# EAGLE design RFID_Reader_v1.0 (EAGLE 9.6.2)
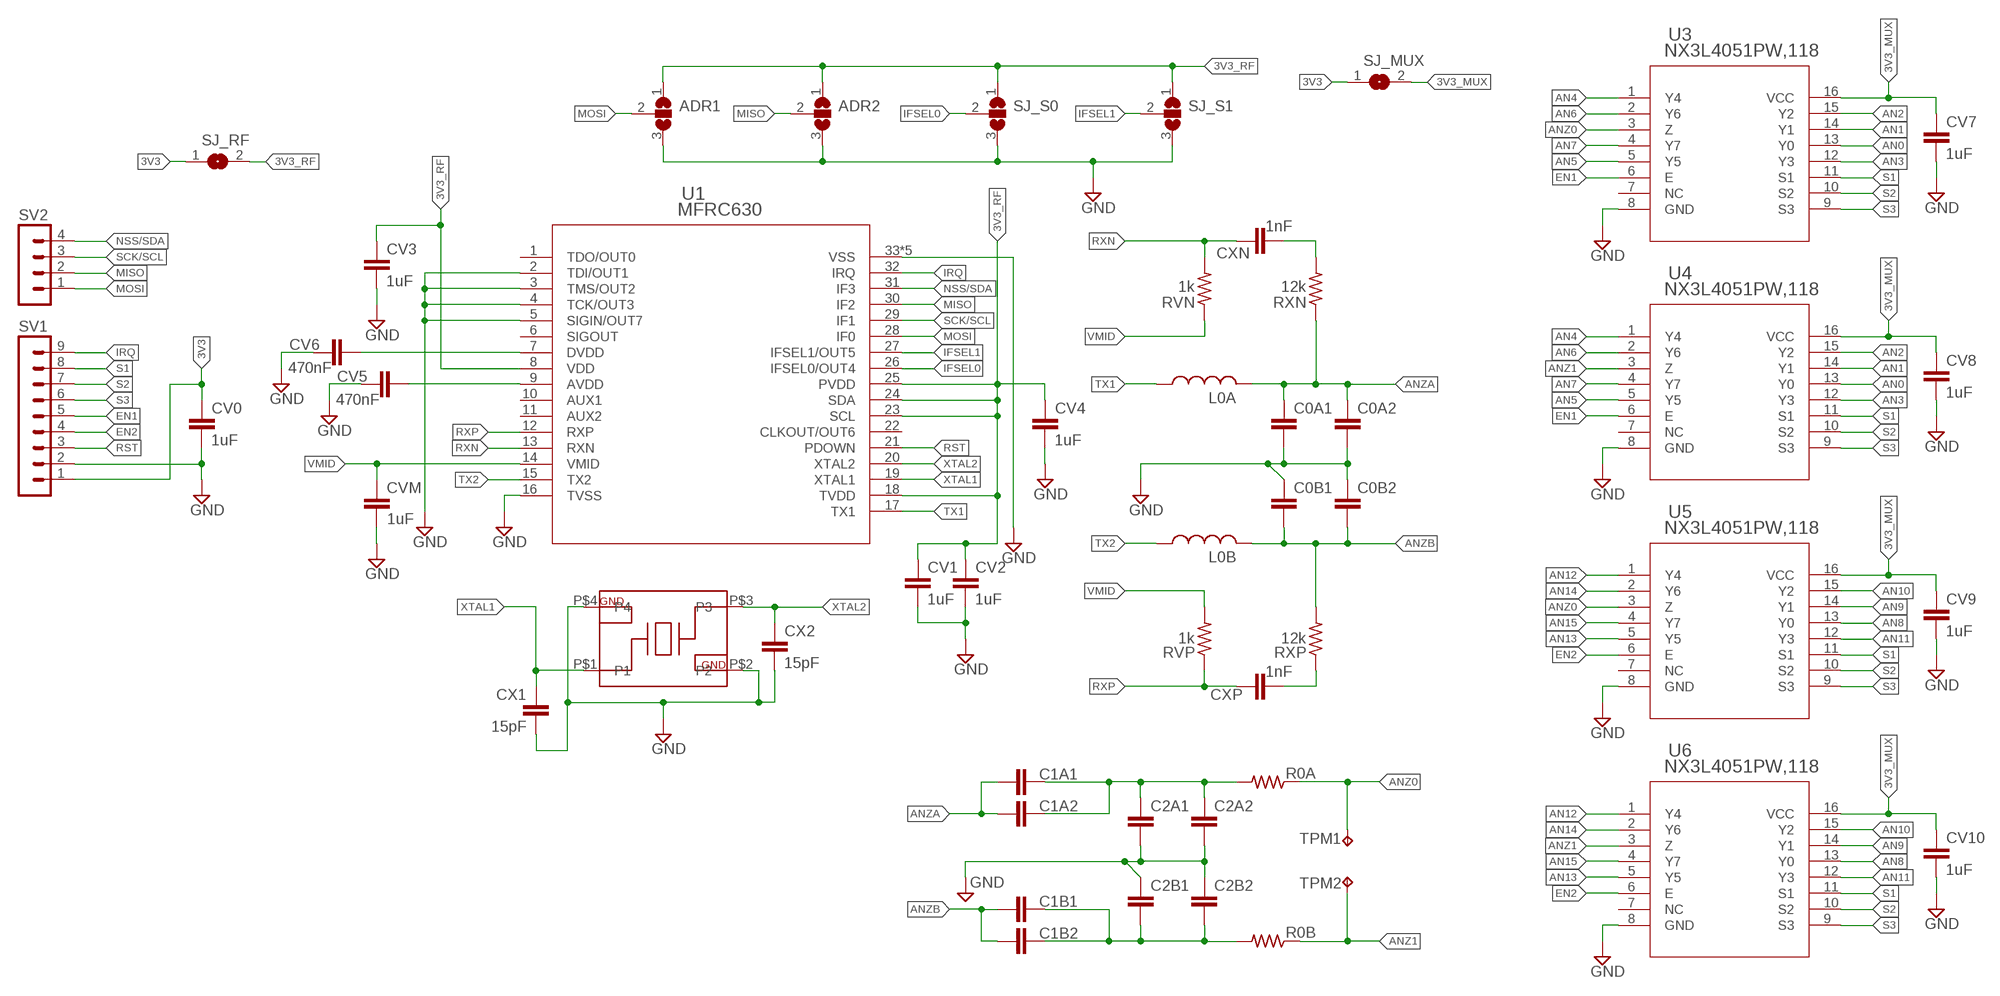
[diagram p0: schematic, sheet 1]

## Parts
ADR1  SJ2W  [SJ_2]
ADR2  SJ2W  [SJ_2]
C0A1  C-EUC0805  [C0805]
C0A2  C-EUC0805  [C0805]
C0B1  C-EUC0805  [C0805]
C0B2  C-EUC0805  [C0805]
C1A1  C-EUC0805  [C0805]
C1A2  C-EUC0805  [C0805]
C1B1  C-EUC0805  [C0805]
C1B2  C-EUC0805  [C0805]
C2A1  C-EUC0805  [C0805]
C2A2  C-EUC0805  [C0805]
C2B1  C-EUC0805  [C0805]
C2B2  C-EUC0805  [C0805]
CV0  1uF  C-EUC0402  [C0402]
CV1  1uF  C-EUC0402  [C0402]
CV2  1uF  C-EUC0402  [C0402]
CV3  1uF  C-EUC0402  [C0402]
CV4  1uF  C-EUC0402  [C0402]
CV5  470nF  C-EUC0402  [C0402]
CV6  470nF  C-EUC0402  [C0402]
CV7  1uF  C-EUC0402  [C0402]
CV8  1uF  C-EUC0402  [C0402]
CV9  1uF  C-EUC0402  [C0402]
CV10  1uF  C-EUC0402  [C0402]
CVM  1uF  C-EUC0402  [C0402]
CX1  15pF  C-EUC0402  [C0402]
CX2  15pF  C-EUC0402  [C0402]
CXN  1nF  C-EUC0805  [C0805]
CXP  1nF  C-EUC0805  [C0805]
L0A  L0806  [L0806]
L0B  L0806  [L0806]
R0A  R-US_R0805  [R0805]
R0B  R-US_R0805  [R0805]
RVN  1k  R-US_R0805  [R0805]
RVP  1k  R-US_R0805  [R0805]
RXN  12k  R-US_R0805  [R0805]
RXP  12k  R-US_R0805  [R0805]
SJ_MUX  SJ  [SJ]
SJ_RF  SJ  [SJ]
SJ_S0  SJ2W  [SJ_2]
SJ_S1  SJ2W  [SJ_2]
SV1  MA09-1  [MA09-1]
SV2  MA04-1  [MA04-1]
TPM1  TPTP10R  [TP10R]
TPM2  TPTP10R  [TP10R]
U1  MFRC630  MFRC63002HN,118HVQFN32_SOT617-1_NXP-M  [HVQFN32_SOT617-1_NXP-M]
U2  E3SB27  E3SB27E0X000VEE3SB27E0X000VE  [DFN320X250X75-4N]
U3  NX3L4051PW,118  NX3L4051PW,118TSSOP16_NXP-M  [TSSOP16_NXP-M]
U4  NX3L4051PW,118  NX3L4051PW,118TSSOP16_NXP-M  [TSSOP16_NXP-M]
U5  NX3L4051PW,118  NX3L4051PW,118TSSOP16_NXP-M  [TSSOP16_NXP-M]
U6  NX3L4051PW,118  NX3L4051PW,118TSSOP16_NXP-M  [TSSOP16_NXP-M]

## Nets
3V3: CV0.1 SJ_MUX.1 SJ_RF.1 SV1.1
3V3_MUX: CV7.1 CV8.1 CV9.1 CV10.1 SJ_MUX.2 U3.16(VCC) U4.16(VCC) U5.16(VCC) U6.16(VCC)
3V3_RF: ADR1.1 ADR2.1 CV1.1 CV2.1 CV3.1 CV4.1 SJ_RF.2 SJ_S0.1 SJ_S1.1 U1.8(VDD) U1.18(TVDD) U1.23(SCL) U1.24(SDA) U1.25(PVDD)
AN0: U3.13(Y0) U4.13(Y0)
AN1: U3.14(Y1) U4.14(Y1)
AN2: U3.15(Y2) U4.15(Y2)
AN3: U3.12(Y3) U4.12(Y3)
AN4: U3.1(Y4) U4.1(Y4)
AN5: U3.5(Y5) U4.5(Y5)
AN6: U3.2(Y6) U4.2(Y6)
AN7: U3.4(Y7) U4.4(Y7)
AN8: U5.13(Y0) U6.13(Y0)
AN9: U5.14(Y1) U6.14(Y1)
AN10: U5.15(Y2) U6.15(Y2)
AN11: U5.12(Y3) U6.12(Y3)
AN12: U5.1(Y4) U6.1(Y4)
AN13: U5.5(Y5) U6.5(Y5)
AN14: U5.2(Y6) U6.2(Y6)
AN15: U5.4(Y7) U6.4(Y7)
ANZ0: R0A.1 TPM1.TP U3.3(Z) U5.3(Z)
ANZ1: R0B.1 TPM2.TP U4.3(Z) U6.3(Z)
ANZA: C0A1.1 C0A2.1 C1A1.2 C1A2.2 L0A.2 RXN.1
ANZB: C0B1.2 C0B2.2 C1B1.2 C1B2.2 L0B.2 RXP.2
EN1: SV1.5 U3.6(E) U4.6(E)
EN2: SV1.4 U5.6(E) U6.6(E)
GND: ADR1.3 ADR2.3 C0A1.2 C0A2.2 C0B1.1 C0B2.1 C2A1.2 C2A2.2 C2B1.1 C2B2.1 CV0.2 CV1.2 CV2.2 CV3.2 CV4.2 CV5.2 CV6.2 CV7.2 CV8.2 CV9.2 CV10.2 CVM.2 CX1.2 CX2.2 SJ_S0.3 SJ_S1.3 SV1.2 U1.2(TDI/OUT1) U1.3(TMS/OUT2) U1.4(TCK/OUT3) U1.5(SIGIN/OUT7) U1.16(TVSS) U1.33(VSS) U1.P$1(VSS) U1.P$2(VSS) U1.P$3(VSS) U1.P$4(VSS) U2.P$2(P2) U2.P$4(P4) U3.8(GND) U4.8(GND) U5.8(GND) U6.8(GND)
IFSEL0: SJ_S0.2 U1.26(IFSEL0/OUT4)
IFSEL1: SJ_S1.2 U1.27(IFSEL1/OUT5)
IRQ: SV1.9 U1.32(IRQ)
MISO: ADR2.2 SV2.2 U1.30(IF2)
MOSI: ADR1.2 SV2.1 U1.28(IF0)
N$1: C1B1.1 C1B2.1 C2B1.2 C2B2.2 R0B.2
N$2: CXN.2 RXN.2
N$3: C1A1.1 C1A2.1 C2A1.1 C2A2.1 R0A.2
N$19: CXP.2 RXP.1
N$26: CV6.1 U1.7(DVDD)
N$28: CV5.1 U1.9(AVDD)
NSS/SDA: SV2.4 U1.31(IF3)
RST: SV1.3 U1.21(PDOWN)
RXN: CXN.1 RVN.2 U1.13(RXN)
RXP: CXP.1 RVP.1 U1.12(RXP)
S1: SV1.8 U3.11(S1) U4.11(S1) U5.11(S1) U6.11(S1)
S2: SV1.7 U3.10(S2) U4.10(S2) U5.10(S2) U6.10(S2)
S3: SV1.6 U3.9(S3) U4.9(S3) U5.9(S3) U6.9(S3)
SCK/SCL: SV2.3 U1.29(IF1)
TX1: L0A.1 U1.17(TX1)
TX2: L0B.1 U1.15(TX2)
VMID: CVM.1 RVN.1 RVP.2 U1.14(VMID)
XTAL1: CX1.1 U1.19(XTAL1) U2.P$1(P1)
XTAL2: CX2.1 U1.20(XTAL2) U2.P$3(P3)
Unconnected: U1.1(TDO/OUT0) U1.6(SIGOUT) U1.10(AUX1) U1.11(AUX2) U1.22(CLKOUT/OUT6) U3.7(NC) U4.7(NC) U5.7(NC) U6.7(NC)

## Library data of the parts
ADR1 ADR2 SJ_S0 SJ_S1 = jumper:SJ2W: SMD solder JUMPER
C0A1 C0A2 C0B1 C0B2 C1A1 C1A2 C1B1 C1B2 C2A1 C2A2 C2B1 C2B2 CV0 CV1-CV10 CVM CX1 CX2 CXN CXP = rcl:C-EU: CAPACITOR, European symbol; SPICEPREFIX: C
L0A L0B = SMD_Components:L0806
R0A R0B RVN RVP RXN RXP = rcl:R-US_: RESISTOR, American symbol; SPICEPREFIX: R
SJ_MUX SJ_RF = jumper:SJ: SMD solder JUMPER
SV1 = con-lstb:MA09-1: PIN HEADER; OC_FARNELL: unknown; OC_NEWARK: unknown
SV2 = con-lstb:MA04-1: PIN HEADER; OC_FARNELL: unknown; OC_NEWARK: unknown
TPM1 TPM2 = testpad:TP: Test pad
U1 = MFRC630:MFRC63002HN,118; COPYRIGHT: Copyright (C) 2024 Ultra Librarian. All rights reserved.; MANUFACTURER_PART_NUMBER: MFRC63002HN,118; MFR_NAME: NXP
U2 = E3SB27E0X000VE:E3SB27E0X000VE
U3-U6 = NX3L4051PW,118:NX3L4051PW,118; COPYRIGHT: Copyright (C) 2024 Ultra Librarian. All rights reserved.; MANUFACTURER_PART_NUMBER: NX3L4051PW,118; MFR_NAME: NXP

## Board
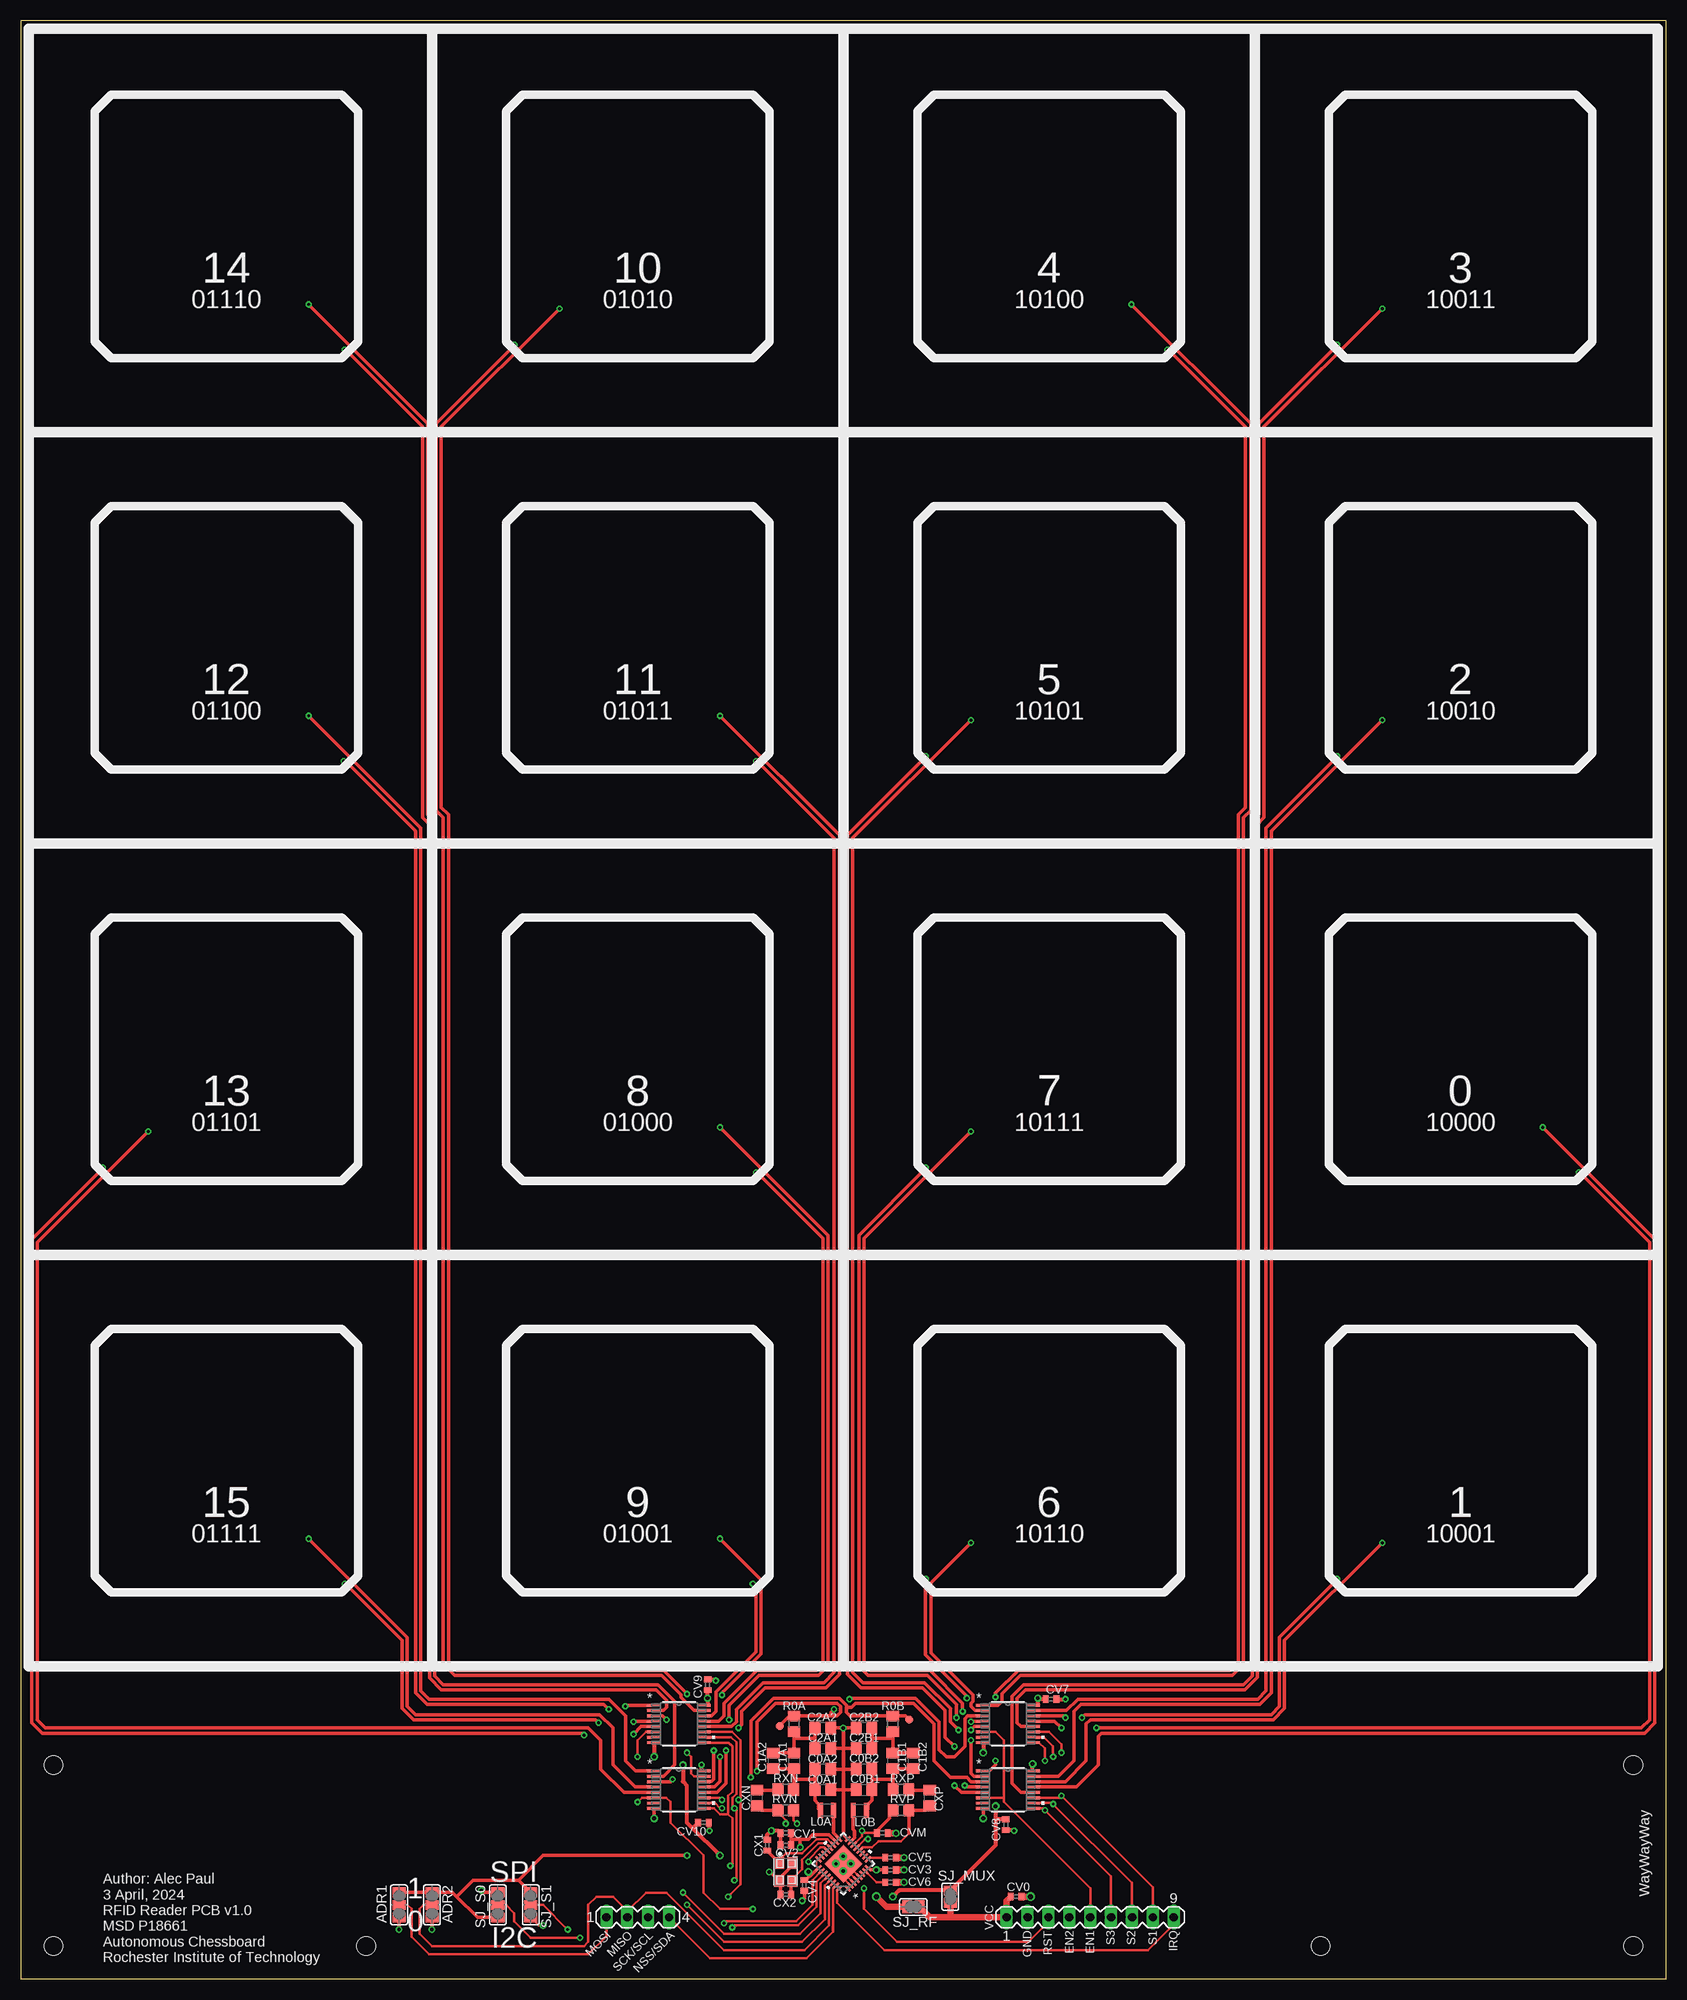
[diagram p1: board, top side]
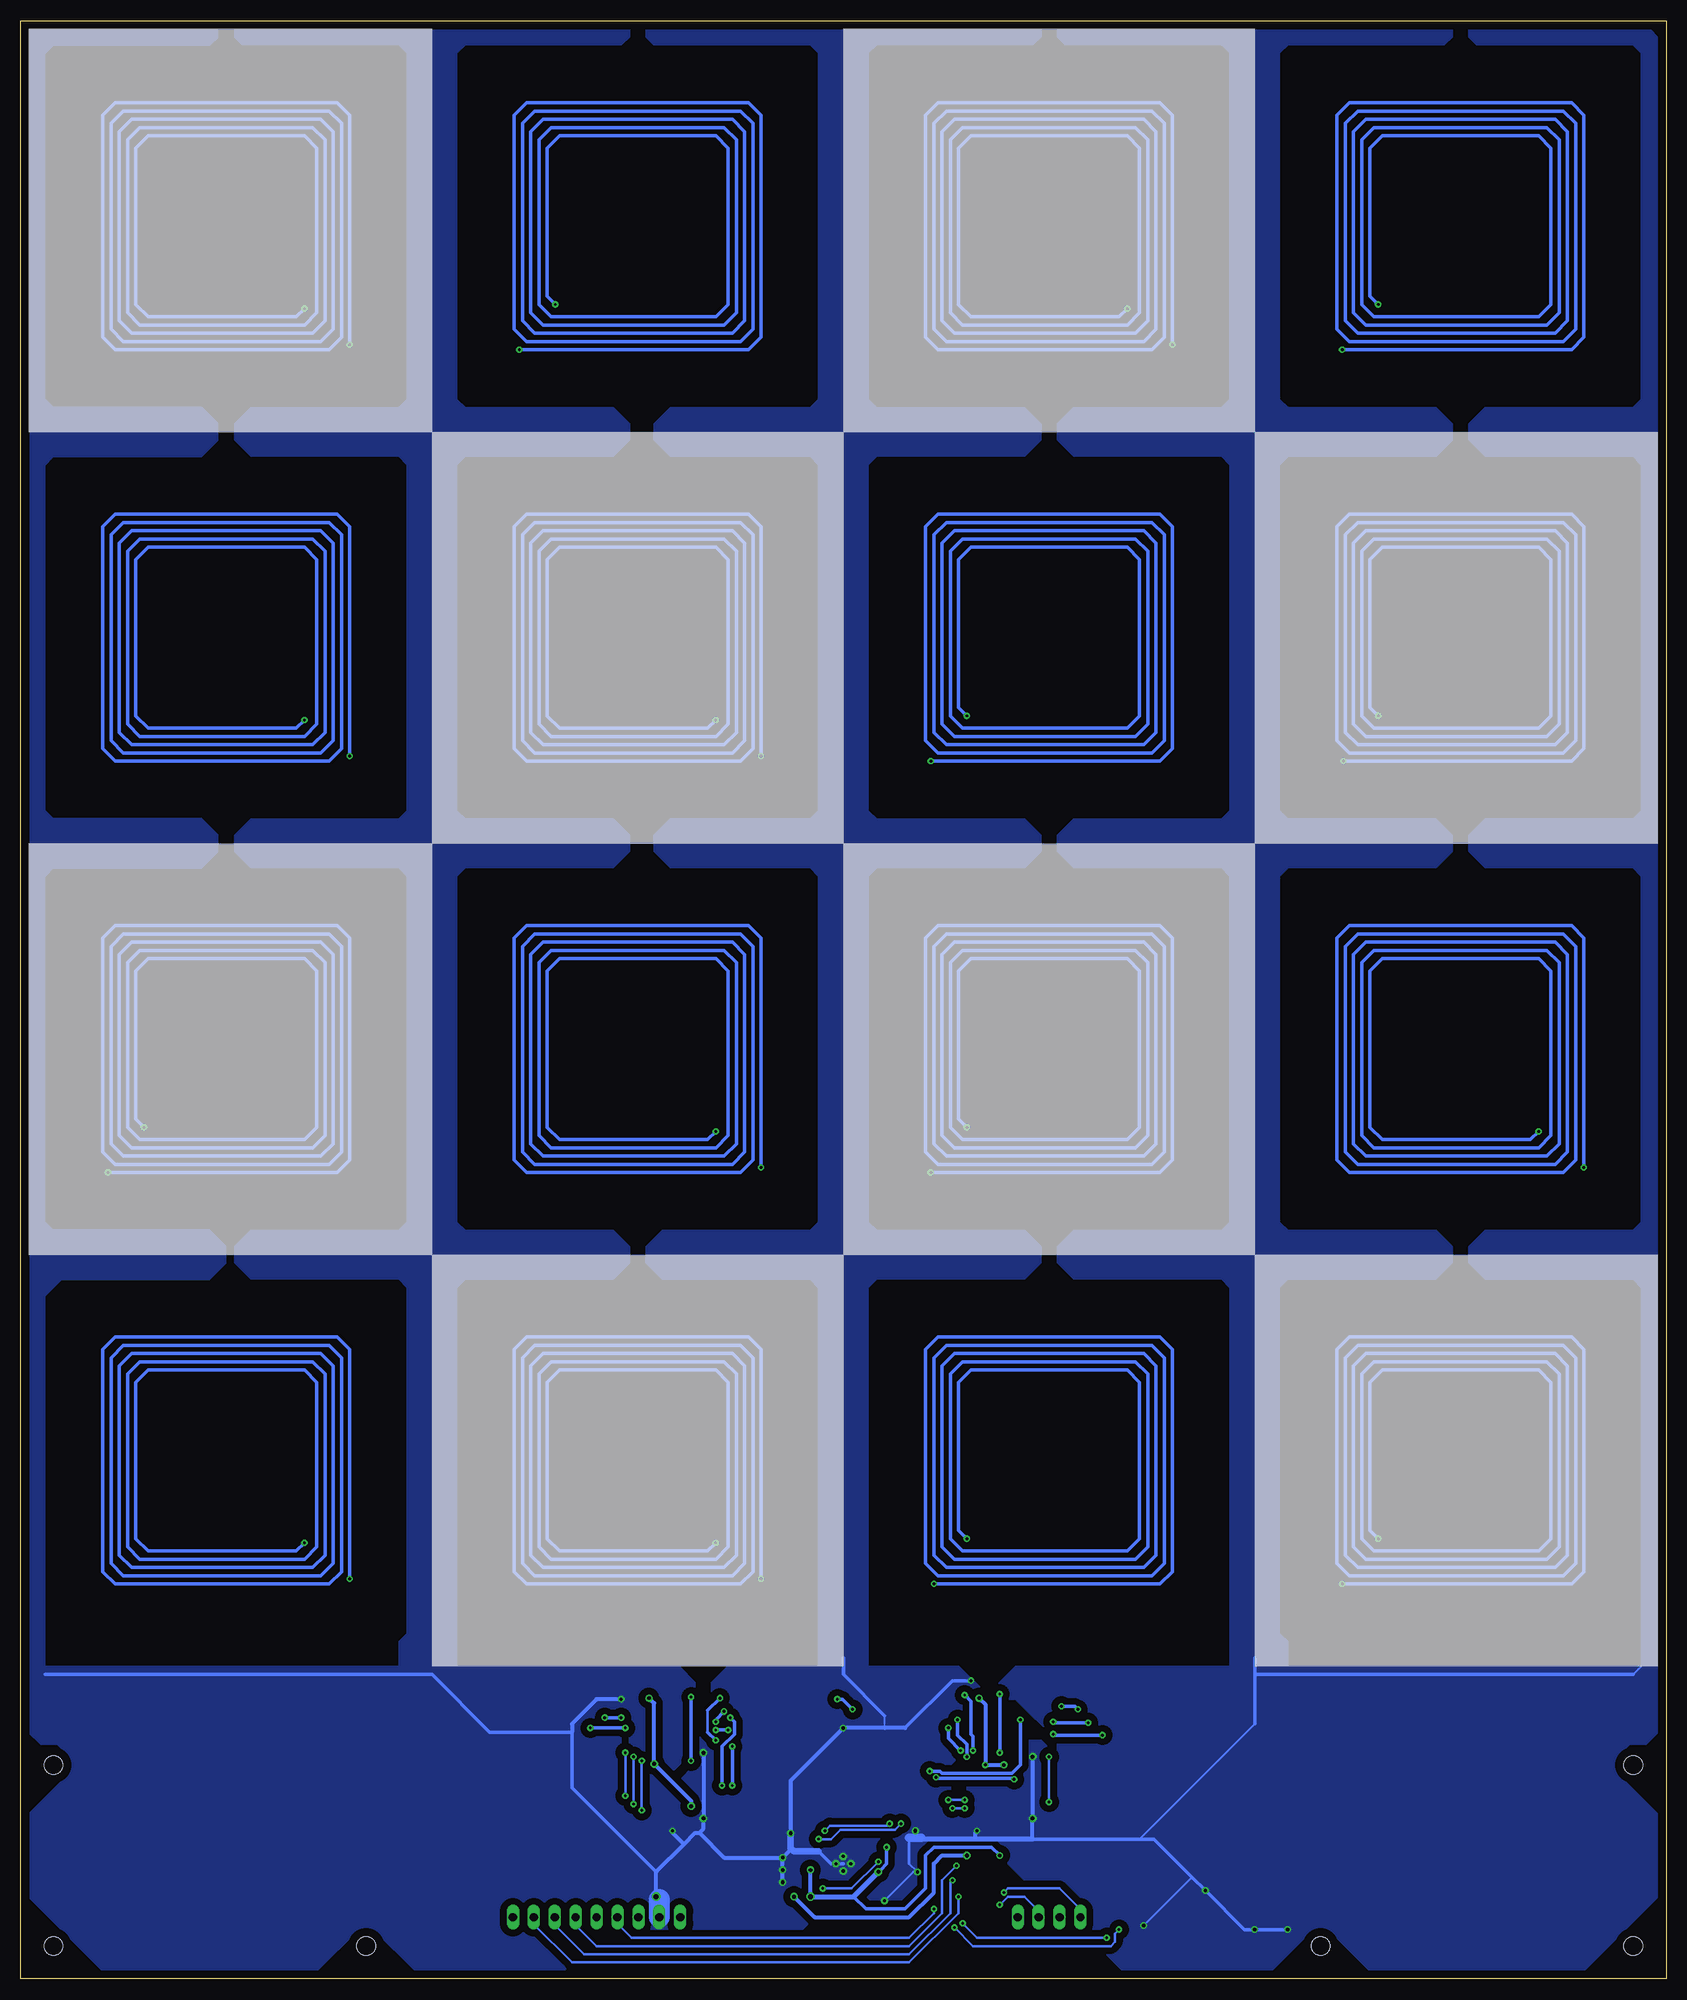
[diagram p2: board, bottom side, seen from below]

Size 200 x 238 mm. Coordinates in mm from the lower left corner, seen from the top.
Outline: 0,0 200,0 200,238 0,238 0,0
Copper layers (1*16): Top 0.035mm / dielectric 1.5mm / Bottom 0.035mm
Design rules "default *": minimum track width 6mil, minimum drill 0.35mm, track to track 5mil, track to pad 5mil, pad to pad 5mil, via to via 5mil, smd to smd 5mil, copper to edge 40mil, drill to drill 6mil, minimum pad ring 10mil, minimum via ring 8mil, stop-mask expansion 4mil, vias tented up to drill 0mil, thermal gap 10mil
Holes 2.3 mm at 4,4 4,26 196,4 196,26 42,4 158,4

### Footprints (pad centres in the part's own frame; a part is rotated, then mirrored left to right if it is on the bottom)
SJ_2 = smd 1.168 x 1.6: 1 -1.524,0; 2 0,0; 3 1.524,0
C0805 = smd 1.3 x 1.5: 1 -0.95,0; 2 0.95,0
C0402 = smd 0.7 x 0.9: 1 -0.65,0; 2 0.65,0
L0806 = smd 0.6 x 1.8: 1 -0.8,0; 2 0.8,0
R0805 = smd 1.3 x 1.5: 1 -0.95,0; 2 0.95,0
SJ = smd 1.168 x 1.6: 1 -0.762,0; 2 0.762,0
MA09-1 = drill 1.016 long: 1 -10.16,0; 2 -7.62,0; 3 -5.08,0; 4 -2.54,0; 5 0,0; 6 2.54,0; 7 5.08,0; 8 7.62,0; 9 10.16,0
MA04-1 = drill 1.016 long: 1 -3.81,0; 2 -1.27,0; 3 1.27,0; 4 3.81,0
TP10R = smd 1 x 1: TP 0,0
HVQFN32_SOT617-1_NXP-M = smd 0.914 x 0.254: 1 -2.502,1.75; 2 -2.502,1.25; 3 -2.502,0.75; 4 -2.502,0.25; 5 -2.502,-0.25; 6 -2.502,-0.75; 7 -2.502,-1.25; 8 -2.502,-1.75; 17 2.502,-1.75; 18 2.502,-1.25; 19 2.502,-0.75; 20 2.502,-0.25; 21 2.502,0.25; 22 2.502,0.75; 23 2.502,1.25; 24 2.502,1.75 | smd 0.254 x 0.914: 9 -1.75,-2.502; 10 -1.25,-2.502; 11 -0.75,-2.502; 12 -0.25,-2.502; 13 0.25,-2.502; 14 0.75,-2.502; 15 1.25,-2.502; 16 1.75,-2.502; 25 1.75,2.502; 26 1.25,2.502; 27 0.75,2.502; 28 0.25,2.502; 29 -0.25,2.502; 30 -0.75,2.502; 31 -1.25,2.502; 32 -1.75,2.502 | smd 3.251 x 3.251: 33 0,0 | drill 0.4: P$1 -0.635,0.635; P$2 0.635,0.635; P$3 -0.635,-0.635; P$4 0.635,-0.635
DFN320X250X75-4N = smd 1.4 x 1.2: P$1 -1.1,-0.8; P$2 1.1,-0.8; P$3 1.1,0.8; P$4 -1.1,0.8
TSSOP16_NXP-M = smd 1.613 x 0.356: 1 -3.054,2.275; 2 -3.054,1.625; 3 -3.054,0.975; 4 -3.054,0.325; 5 -3.054,-0.325; 6 -3.054,-0.975; 7 -3.054,-1.625; 8 -3.054,-2.275; 9 3.054,-2.275; 10 3.054,-1.625; 11 3.054,-0.975; 12 3.054,-0.325; 13 3.054,0.325; 14 3.054,0.975; 15 3.054,1.625; 16 3.054,2.275

### Placement (x,y rotation side)
ADR1  46,9 270 top
ADR2  50,9 270 top
C0A1  97.5,23 0 top
C0A2  97.5,25.5 0 top
C0B1  102.5,23 0 top
C0B2  102.5,25.5 0 top
C1A1  94,26.5 270 top
C1A2  91.5,26.5 270 top
C1B1  108.5,26.5 270 top
C1B2  106,26.5 270 top
C2A1  97.5,28 0 top
C2A2  97.5,30.5 0 top
C2B1  102.5,28 0 top
C2B2  102.5,30.5 0 top
CV0  121,10 0 top
CV1  93,17.75 180 top
CV2  93,16.25 180 top
CV3  105.75,13.25 0 top
CV4  95.25,11.38 270 top
CV5  105.75,14.75 0 top
CV6  105.75,11.75 0 top
CV7  125.25,34 0 top
CV8  119.75,18.75 270 top
CV9  83.5,35.75 90 top
CV10  83,19 0 top
CVM  104.75,17.75 0 top
CX1  90.75,16.25 90 top
CX2  93,10.25 180 top
CXN  89.5,22 90 top
CXP  110.5,22 90 top
L0A  98,20.5 180 top
L0B  102,20.5 0 top
R0A  94,31 270 top
R0B  106,31 270 top
RVN  93,20.5 180 top
RVP  107,20.5 180 top
RXN  93,23 180 top
RXP  107,23 180 top
SJ_MUX  113,10 90 top
SJ_RF  108.5,8.75 180 top
SJ_S0  58,9 90 top
SJ_S1  62,9 270 top
SV1  130,7.5 0 top
SV2  75,7.5 0 top
TPM1  92.25,30.75 0 top
TPM2  108,31.5 0 top
U1  100,14 135 top
U2  93,13 270 top
U3  120,31 0 top
U4  120,23 0 top
U5  80,31 0 top
U6  80,23 0 top

### Tracks (layer width: path | path; a pad name or v marks a point on that pad's centre or on a via)
3V3
  Top 0.813: 113,7.5 SV1.1 119.84,9.49 CV0.1 | SJ_MUX.1 113,7.5 | SJ_RF.1 110.51,7.5 113,7.5
3V3_MUX  (via drill 0.35, 0.45, 0.5)
  Top 0.406: 83.5,33.27 U5.16 | U6.16 83,25.33 82.75,25.33 | U3.16 123.53,33.27 123.62,33.38 | U4.16 123,25.33 | 81.72,18.38 81.62,18.38
  Top 0.508: v106,10 106.76,10.76 SJ_MUX.2 118.5,16.26 118.5,19.5 | 83.5,33.27 v83.5,34.12 CV9.1 | 82.75,25.33 v82.75,26 | v85,15 81.62,18.38 81,19 81,23.5 80.5,24 v80.5,26 | 123.62,33.38 v123.62,34.12 123.75,34 CV7.1 | 123,25.33 v123,26.12 | CV10.1 81.72,18.38 | v118.5,21 118.5,19.5 | CV8.1 118.6,19.4 118.5,19.5
  Bottom 0.508: v106,10 103.5,7.5 92,7.5 89,10.5 89,14 88,15 v85,15 | v123.62,34.12 123,33.5 v123,26.12 118.5,21.62 v118.5,21 | v83.5,34.12 82.75,33.38 v82.75,26 v80.5,26
3V3_RF  (via drill 0.4, 0.45, 0.5, 0.6)
  Top 0.203: 96.92,13.47 U1.25 96.75,13.71 96.75,14.29 U1.24 | U1.8 103.13,13.47
  Top 0.254: U1.24 U1.23
  Top 0.406: CV2.1 93.65,17 | 93.65,17 CV1.1 | U1.18 98.27,17.5 96.25,17.5 95.75,17 94.75,17 | CV4.1 95.47,12.02 96.22,12.77 | 96.92,13.47 96.22,12.77 | 96.22,12.77 95.97,12.77 v95.75,13 | 103.13,13.47 103.35,13.25 v104,13.25 CV3.1 | 94.75,17 93.65,17 | v94.75,16 94.75,17 | ADR1.1 ADR2.1 52.48,10.52 53,10 | SJ_S0.1 55.52,7.48 53,10 | SJ_S1.1 60.52,12 | 53,10 55,12 60.52,12 | v81,15 63.52,15 60.52,12
  Top 0.813: SJ_RF.2 105.25,8.75 v104,10
  Bottom 0.406: v95.75,13 95.46,13.29 94.75,14 v94.75,16 | 98.75,10 97.25,8.5 92.5,8.5 90,11 90,15 89,16 82,16 v81,15
  Bottom 0.508: v104,10 v104,13.25
  Bottom 0.61: v104,10 98.75,10 v95.75,13
AN0  (via drill 0.35)
  Top 0.406: U3.13 125.67,31.32 v126.5,30.5 | U4.13 128.32,23.32 131,26 131,29.5 131.38,29.88 197.38,29.88 198.62,31.12 198.62,89.88 v185,103.5 | v130.75,30.5 197,30.5 198,31.5 198,89.5 189.5,98 v189.38,98
  Bottom 0.406: v130.75,30.5 v126.5,30.5 | v189.38,98 161.5,98 160,99.5 160,126.5 161.5,128 188.5,128 190,126.5 190,100.5 188.5,99 162.5,99 161,100.5 161,125.5 162.5,127 187.5,127 189,125.5 189,101.5 187.5,100 163.5,100 162,101.5 162,124.5 163.5,126 186.5,126 188,124.5 188,102.5 186.5,101 164.5,101 163,102.5 163,123.5 164.5,125 185.5,125 187,123.5 187,103.5 185.5,102 165.5,102 164,103.5 164,122.5 165.5,124 184.5,124 186,122.5 186,104.5 v185,103.5
AN1  (via drill 0.35)
  Top 0.406: v127,31.75 126.78,31.98 U3.14 | v129,31.75 129.38,32.12 152,32.12 153,33.12 153,41.5 160,48.5 v160,48.62 | U4.14 126.97,23.98 129.5,26.5 129.5,31 130,31.5 152.25,31.5 153.62,32.88 153.62,41.12 v165.5,53
  Bottom 0.406: v127,31.75 v129,31.75 | v160,48.62 160,76.5 161.5,78 188.5,78 190,76.5 190,49.5 188.5,48 162.5,48 161,49.5 161,75.5 162.5,77 187.5,77 189,75.5 189,50.5 187.5,49 163.5,49 162,50.5 162,74.5 163.5,76 186.5,76 188,74.5 188,51.5 186.5,50 164.5,50 163,51.5 163,73.5 164.5,75 185.5,75 187,73.5 187,52.5 185.5,51 165.5,51 164,52.5 164,72.5 165.5,74 184.5,74 186,72.5 186,53.5 184.5,52 166.5,52 v165.5,53
AN2  (via drill 0.35)
  Top 0.406: U3.15 127.12,32.62 128.5,34 150.38,34 151.38,35 151.38,139.88 160,148.5 v160,148.62 | U4.15 126.12,24.62 128,26.5 128,32.5 128.88,33.38 150.62,33.38 152,34.75 152,139.5 v165.5,153
  Bottom 0.406: v160,148.62 160,176.5 161.5,178 188.5,178 190,176.5 190,149.5 188.5,148 162.5,148 161,149.5 161,175.5 162.5,177 187.5,177 189,175.5 189,150.5 187.5,149 163.5,149 162,150.5 162,174.5 163.5,176 186.5,176 188,174.5 188,151.5 186.5,150 164.5,150 163,151.5 163,173.5 164.5,175 185.5,175 187,173.5 187,152.5 185.5,151 165.5,151 164,152.5 164,172.5 165.5,174 184.5,174 186,172.5 186,153.5 184.5,152 166.5,152 v165.5,153
AN3  (via drill 0.35)
  Top 0.406: U3.12 121.58,30.68 121.12,31.12 121.12,34.12 122.12,35.12 148.81,35.12 150.31,36.62 150.31,140.31 151.12,141.12 151.12,188.62 v165.5,203 | U4.12 121.58,22.68 120.5,23.75 120.5,34.38 121.88,35.75 148.62,35.75 149.69,36.81 149.69,140.69 150.5,141.5 150.5,189 160,198.5 v160,198.62
  Bottom 0.406: v160,198.62 160,226.5 161.5,228 188.5,228 190,226.5 190,199.5 188.5,198 162.5,198 161,199.5 161,225.5 162.5,227 187.5,227 189,225.5 189,200.5 187.5,199 163.5,199 162,200.5 162,224.5 163.5,226 186.5,226 188,224.5 188,201.5 186.5,200 164.5,200 163,201.5 163,223.5 164.5,225 185.5,225 187,223.5 187,202.5 185.5,201 165.5,201 164,202.5 164,222.5 165.5,224 184.5,224 186,222.5 186,203.5 184.5,202 166.5,202 v165.5,203
AN4  (via drill 0.35)
  Top 0.406: U4.1 117.78,25.27 118.5,26 v118.5,26.5 | v118.5,34.25 118.5,34.75 121.25,37.5 147,37.5 148,38.5 148,141.5 148.88,142.38 148.88,188.62 139.5,198 v139.38,198 | U3.1 118.78,33.27 119.25,33.75 119.25,34.62 121.5,36.88 147.25,36.88 148.62,38.25 148.62,141.12 149.5,142 149.5,189 v135,203.5
  Bottom 0.406: v118.5,34.25 v118.5,26.5 | v139.38,198 111.5,198 110,199.5 110,226.5 111.5,228 138.5,228 140,226.5 140,200.5 138.5,199 112.5,199 111,200.5 111,225.5 112.5,227 137.5,227 139,225.5 139,201.5 137.5,200 113.5,200 112,201.5 112,224.5 113.5,226 136.5,226 138,224.5 138,202.5 136.5,201 114.5,201 113,202.5 113,223.5 114.5,225 135.5,225 137,223.5 137,203.5 135.5,202 115.5,202 114,203.5 114,222.5 115.5,224 134.5,224 136,222.5 136,204.5 v135,203.5
AN5  (via drill 0.35)
  Top 0.406: U4.5 114.33,22.68 v113.5,23.5 | v113.5,28.25 112.38,29.38 112.38,32.62 109.62,35.38 102.12,35.38 100.5,37 100.5,139 110,148.5 v110,148.62 | U3.5 115.92,30.68 v115.5,30.25 | v114,30.25 113,31.25 113,32.88 109.88,36 102.38,36 101.12,37.25 101.12,138.62 v115.5,153
  Bottom 0.406: v115.5,30.25 v114,30.25 | v113.5,23.5 v113.5,28.25 | v110,148.62 110,176.5 111.5,178 138.5,178 140,176.5 140,149.5 138.5,148 112.5,148 111,149.5 111,175.5 112.5,177 137.5,177 139,175.5 139,150.5 137.5,149 113.5,149 112,150.5 112,174.5 113.5,176 136.5,176 138,174.5 138,151.5 136.5,150 114.5,150 113,151.5 113,173.5 114.5,175 135.5,175 137,173.5 137,152.5 135.5,151 115.5,151 114,152.5 114,172.5 115.5,174 134.5,174 136,172.5 136,153.5 134.5,152 116.5,152 v115.5,153
AN6  (via drill 0.35)
  Top 0.406: v115,34.12 115,34.38 110,39.38 v110,48.62 | U3.2 116,32.62 115.5,33.12 115.5,33.5 115.75,33.75 115.75,34.5 110.62,39.62 110.62,48.12 v115.5,53 | U4.2 115.88,24.62 115.5,25 v115.5,29
  Bottom 0.305: 116.5,30 116.5,32.62
  Bottom 0.406: v115.5,29 116.5,30 | 116.5,32.62 v115,34.12 | v110,48.62 110,76.5 111.5,78 138.5,78 140,76.5 140,49.5 138.5,48 112.5,48 111,49.5 111,75.5 112.5,77 137.5,77 139,75.5 139,50.5 137.5,49 113.5,49 112,50.5 112,74.5 113.5,76 136.5,76 138,74.5 138,51.5 136.5,50 114.5,50 113,51.5 113,73.5 114.5,75 135.5,75 137,73.5 137,52.5 135.5,51 115.5,51 114,52.5 114,72.5 115.5,74 134.5,74 136,72.5 136,53.5 134.5,52 116.5,52 v115.5,53
AN7  (via drill 0.35)
  Top 0.406: U4.4 114.92,23.32 v114.75,23.5 | v113.75,31.75 113.75,33.38 110.25,36.88 103,36.88 101.88,38 101.88,90.38 110,98.5 v110,98.62 | U3.4 115.58,31.32 v115.5,31.25 | v114.5,32.5 114.5,33.5 110.5,37.5 103.25,37.5 102.5,38.25 102.5,90 v115.5,103
  Bottom 0.406: v113.75,31.75 113.25,31.25 113.25,29.75 114.75,28.25 v114.75,23.5 | v115.5,31.25 115.5,31.5 v114.5,32.5 | v110,98.62 110,126.5 111.5,128 138.5,128 140,126.5 140,99.5 138.5,98 112.5,98 111,99.5 111,125.5 112.5,127 137.5,127 139,125.5 139,100.5 137.5,99 113.5,99 112,100.5 112,124.5 113.5,126 136.5,126 138,124.5 138,101.5 136.5,100 114.5,100 113,101.5 113,123.5 114.5,125 135.5,125 137,123.5 137,102.5 135.5,101 115.5,101 114,102.5 114,122.5 115.5,124 134.5,124 136,122.5 136,103.5 134.5,102 116.5,102 v115.5,103
AN8  (via drill 0.35)
  Top 0.406: U6.13 84.33,23.32 85,24 v85,27 | v86.12,31.5 86.12,33.25 89.75,36.88 97,36.88 98.12,38 98.12,90.38 v85,103.5 | U5.13 84.83,31.32 85.5,32 85.5,33.5 89.5,37.5 96.75,37.5 97.5,38.25 97.5,90 89.5,98 v89.38,98
  Bottom 0.406: v85,27 85,28.5 86.12,29.62 v86.12,31.5 | v89.38,98 61.5,98 60,99.5 60,126.5 61.5,128 88.5,128 90,126.5 90,100.5 88.5,99 62.5,99 61,100.5 61,125.5 62.5,127 87.5,127 89,125.5 89,101.5 87.5,100 63.5,100 62,101.5 62,124.5 63.5,126 86.5,126 88,124.5 88,102.5 86.5,101 64.5,101 63,102.5 63,123.5 64.5,125 85.5,125 87,123.5 87,103.5 85.5,102 65.5,102 64,103.5 64,122.5 65.5,124 84.5,124 86,122.5 86,104.5 v85,103.5
AN9  (via drill 0.35)
  Top 0.406: U6.14 83.08,24 84,24 84.25,24.25 v84.25,27.75 | v85.25,34.5 85.25,34.75 90,39.5 90,48.5 v85,53.5 | U5.14 83.97,31.98 84.5,32.5 84.5,34.88 89.38,39.75 89.38,47.62 v89,48
  Bottom 0.406: v85.25,34.5 84.5,33.75 84.5,29.75 84.25,29.5 v84.25,27.75 | v89,48 61.5,48 60,49.5 60,76.5 61.5,78 88.5,78 90,76.5 90,50.5 88.5,49 62.5,49 61,50.5 61,75.5 62.5,77 87.5,77 89,75.5 89,51.5 87.5,50 63.5,50 62,51.5 62,74.5 63.5,76 86.5,76 88,74.5 88,52.5 86.5,51 64.5,51 63,52.5 63,73.5 64.5,75 85.5,75 87,73.5 87,53.5 85.5,52 65.5,52 64,53.5 64,72.5 65.5,74 84.5,74 86,72.5 86,54.5 v85,53.5
AN10  (via drill 0.35)
  Top 0.305: U6.15 81.88,24.62 81.5,25 81.5,27 v81,27.5
  Top 0.406: v60,198.62 60,198.5 50.5,189 50.5,142 51.38,141.12 51.38,38.25 52.75,36.88 77.88,36.88 80.25,34.5 80.25,34.25 81.88,32.62 U5.15 | v65.5,203 51.12,188.62 51.12,142.38 52,141.5 52,38.5 53,37.5 78.12,37.5 v81,34.62
  Bottom 0.406: v81,27.5 v81,34.62 | v60,198.62 60,226.5 61.5,228 88.5,228 90,226.5 90,199.5 88.5,198 62.5,198 61,199.5 61,225.5 62.5,227 87.5,227 89,225.5 89,200.5 87.5,199 63.5,199 62,200.5 62,224.5 63.5,226 86.5,226 88,224.5 88,201.5 86.5,200 64.5,200 63,201.5 63,223.5 64.5,225 85.5,225 87,223.5 87,202.5 85.5,201 65.5,201 64,202.5 64,222.5 65.5,224 84.5,224 86,222.5 86,203.5 84.5,202 66.5,202 v65.5,203
AN11  (via drill 0.35)
  Top 0.406: U6.12 84.67,22.68 85.75,23.75 v85.75,27.75 | v87.25,30.5 87.62,30.88 87.62,32.5 90.5,35.38 97.88,35.38 99.5,37 99.5,139 v85,153.5 | U5.12 86.42,30.68 87,31.25 87,32.75 90.25,36 97.62,36 98.88,37.25 98.88,138.62 89.5,148 v89.38,148
  Bottom 0.406: v85.75,27.75 87.25,29.25 v87.25,30.5 | v89.38,148 61.5,148 60,149.5 60,176.5 61.5,178 88.5,178 90,176.5 90,150.5 88.5,149 62.5,149 61,150.5 61,175.5 62.5,177 87.5,177 89,175.5 89,151.5 87.5,150 63.5,150 62,151.5 62,174.5 63.5,176 86.5,176 88,174.5 88,152.5 86.5,151 64.5,151 63,152.5 63,173.5 64.5,175 85.5,175 87,173.5 87,153.5 85.5,152 65.5,152 64,153.5 64,172.5 65.5,174 84.5,174 86,172.5 86,154.5 v85,153.5
AN12  (via drill 0.35)
  Top 0.406: U6.1 74.72,25.27 73.5,26.5 73.5,32 71.5,34 49.62,34 48.62,35 48.62,139.88 v35,153.5 | U5.1 73.65,33.27 v73.5,33.12 | v71.5,32.75 70.88,33.38 49.41,33.38 48,34.78 48,139.5 39.5,148 v39.25,148
  Bottom 0.406: v73.5,33.12 71.88,33.12 v71.5,32.75 | v39.25,148 11.5,148 10,149.5 10,176.5 11.5,178 38.5,178 40,176.5 40,150.5 38.5,149 12.5,149 11,150.5 11,175.5 12.5,177 37.5,177 39,175.5 39,151.5 37.5,150 13.5,150 12,151.5 12,174.5 13.5,176 36.5,176 38,174.5 38,152.5 36.5,151 14.5,151 13,152.5 13,173.5 14.5,175 35.5,175 37,173.5 37,153.5 35.5,152 15.5,152 14,153.5 14,172.5 15.5,174 34.5,174 36,172.5 36,154.5 v35,153.5
AN13  (via drill 0.35)
  Top 0.406: U6.5 73.33,22.68 70.5,25.5 70.5,29 69,30.5 3,30.5 2,31.5 2,89.5 v15.5,103 | U5.5 75.42,30.68 v74.5,29.75 | v68.5,29.62 68.25,29.88 2.62,29.88 1.38,31.12 1.38,89.88 10,98.5 v10,98.62
  Bottom 0.406: v74.5,29.75 74.38,29.62 v68.5,29.62 | v10,98.62 10,126.5 11.5,128 38.5,128 40,126.5 40,99.5 38.5,98 12.5,98 11,99.5 11,125.5 12.5,127 37.5,127 39,125.5 39,100.5 37.5,99 13.5,99 12,100.5 12,124.5 13.5,126 36.5,126 38,124.5 38,101.5 36.5,100 14.5,100 13,101.5 13,123.5 14.5,125 35.5,125 37,123.5 37,102.5 35.5,101 15.5,101 14,102.5 14,122.5 15.5,124 34.5,124 36,122.5 36,103.5 34.5,102 16.5,102 v15.5,103
AN14  (via drill 0.35)
  Top 0.406: U6.2 78.12,24.62 79.5,26 79.5,33.75 77.5,35.75 51.38,35.75 50.31,36.81 50.31,140.69 49.5,141.5 49.5,189 v35,203.5 | U5.2 78.12,32.62 78.5,33 78.5,33.88 77.25,35.12 51.12,35.12 49.69,36.56 49.69,140.31 48.88,141.12 48.88,188.62 39.5,198 v39.38,198
  Bottom 0.406: v35,203.5 36,204.5 36,222.5 34.5,224 15.5,224 14,222.5 14,203.5 15.5,202 35.5,202 37,203.5 37,223.5 35.5,225 14.5,225 13,223.5 13,202.5 14.5,201 36.5,201 38,202.5 38,224.5 36.5,226 13.5,226 12,224.5 12,201.5 13.5,200 37.5,200 39,201.5 39,225.5 37.5,227 12.5,227 11,225.5 11,200.5 12.5,199 38.5,199 40,200.5 40,226.5 38.5,228 11.5,228 10,226.5 10,199.5 11.5,198 v39.38,198
AN15  (via drill 0.35)
  Top 0.406: U6.4 74.67,23.32 72,26 72,30.5 70.38,32.12 48,32.12 47,33.12 47,41.5 v35,53.5 | U5.4 74.58,31.32 v74.5,31.25 | v70.25,31.12 69.88,31.5 47.75,31.5 46.38,32.88 46.38,41.12 39.5,48 v39.38,48
  Bottom 0.406: v74.5,31.25 74.38,31.12 v70.25,31.12 | v39.38,48 11.5,48 10,49.5 10,76.5 11.5,78 38.5,78 40,76.5 40,50.5 38.5,49 12.5,49 11,50.5 11,75.5 12.5,77 37.5,77 39,75.5 39,51.5 37.5,50 13.5,50 12,51.5 12,74.5 13.5,76 36.5,76 38,74.5 38,52.5 36.5,51 14.5,51 13,52.5 13,73.5 14.5,75 35.5,75 37,73.5 37,53.5 35.5,52 15.5,52 14,53.5 14,72.5 15.5,74 34.5,74 36,72.5 36,54.5 v35,53.5
ANZ0  (via drill 0.35)
  Top 0.406: TPM1.TP 93.45,31.95 R0A.1 98.5,31.95 | v100.75,34 100.88,34.12 108.75,34.12 111.62,31.25 111.62,27.88 112.5,27 113.5,27 114.75,28.25 114.75,31.62 115.1,31.98 U3.3 | 98.5,31.95 99.2,31.95 99.62,32.38 99.62,33.12 99.25,33.5 91.75,33.5 89.5,31.25 v89.5,25.25 | v98.88,32.75 98.5,32.38 98.5,31.95 | U5.3 78.03,31.98 v78.5,31.5
  Bottom 0.406: v98.88,32.75 100.12,34 v100.75,34 | v89.5,25.25 88.25,25.25 88,25 79.5,25 78.5,26 v78.5,31.5
ANZ1  (via drill 0.35)
  Top 0.406: TPM2.TP 107.55,31.95 R0B.1 100.8,31.95 100.38,32.38 100.38,33 | 100.38,33 100.38,33.25 99.5,34.12 91.5,34.12 88.75,31.38 v88.75,24.5 | 100.38,33 101,33 101.5,33.5 108.5,33.5 111,31 111,26.5 113,24.5 115,24.5 115.53,23.98 U4.3 | v79.25,24.25 78.97,23.98 U6.3
  Bottom 0.406: v88.75,24.5 88.62,24.38 79.38,24.38 v79.25,24.25
ANZA
  Top 0.406: C1A2.2 C1A1.2 94,24.25 | 96.55,24.25 C0A1.1 96.55,21.7 97,21.25 97,20.7 L0A.2 | 96.55,24.25 C0A2.1 | RXN.1 94,23.05 94,24.25 | 94,24.25 96.55,24.25
ANZB
  Top 0.406: C1B1.2 C1B2.2 106,24.25 | 103.45,24.25 C0B1.2 103.45,21.7 103,21.25 103,20.7 L0B.2 | 103.45,24.25 C0B2.2 | RXP.2 106,23.05 106,24.25 | 106,24.25 103.45,24.25
EN1
  Top 0.305: U3.6 118.47,30.02 119.5,29 119.5,22 | SV1.5 130,11 119.5,21.5 119.5,22 | U4.6 116.97,22 119.5,22
EN2  (via drill 0.35)
  Top 0.305: v89,8.5 85,8.5 83,10.5 83,15 79,19 79,21.5 78.47,22.02 U6.6 75.53,22.02 v75,21.5 | U5.6 76.03,30.02 75,29 v75,27
  Bottom 0.305: SV1.4 127.46,6.71 125.75,5 92,5 89,8 v89,8.5 | v75,27 v75,21.5
GND  (via drill 0.35, 0.4, 0.45, 0.5, 0.6)
  Top 0.152: U1.16 100.51,17.03 | U1.33 U1.P$2
  Top 0.254: U1.3 100,12.94 | 100,12.94 U1.P$1 100.54,13.1 U1.4 | U1.5 100.9,13.46 U1.P$3 | U1.2 100,12.23 100,12.94
  Top 0.305: 93.8,13.8 U2.P$4 | 92.35,11.75 U2.P$2 | SJ_S1.3 62.98,6.5 v63.5,6.5 | 91.1,13 v91,13
  Top 0.406: C0A1.2 100,23 | 100,23 C0B1.1 | C0B2.1 100,25.5 | 100,25.5 C0A2.2 | 100,25.5 100,23 | C2A1.2 100,28 | 100,28 C2B1.1 | 100,28 100,25.5 | v100,30.5 C2B2.1 | v100,30.5 100,28 | CV1.2 CV2.2 | 100,23 100,17.54 100.51,17.03 | 93.8,13.8 92.2,12.2 U2.P$2 91.1,13 | CX2.2 92.35,11.75 | v100,30.5 C2A2.2 | ADR1.3 v46,6 | v50,6 ADR2.3 | v56,10.75 56.23,10.52 SJ_S0.3 | U3.8 117,28.67 | v77,19.5 77,20.67 U6.8 | U5.8 77,28.67 | v117,19.5 117,20.67 U4.8 | CV4.2 95.25,9.75 v95,9.5 | v83.75,18 83.65,18.1
  Top 0.508: 117,28.67 v117,27.5 | 77,28.67 v77,27 | CV1.2 92.1,18 v91.25,18 90.75,17.5 CX1.2 | CV9.2 84.35,36.4 v84.5,36.25 | CV10.2 83.65,18.1 | CV7.2 v127,34 | CV8.2 120.65,18.1 v120.75,18
  Top 0.813: v106.4,17.7 105.45,17.7 CVM.2 | CV0.2 v122.75,10 | CV5.2 v107.38,14.75 | CV3.2 v107.38,13.25 | CV6.2 v107.38,11.75
  Bottom 0.152: 64,17 50,31 | 95,30.5 95,32 | 4,37 3,38
  Bottom 0.305: v63.5,6.5 57.62,12.38 | 92,17.12 92,14 v91,13 91.5,13 v95,9.5
  Bottom 0.406: 90.5,17 90.5,17.12 | v46,6 v50,6 51.25,6 v56,10.75 57.62,12.38 62.25,17 64,17 77,17 | 122.75,13 133,23.25 133,30 143,30 150,37 197,37 | v84.5,36.25 86.75,36.25 92.5,30.5 | 50,31 50,37 | 50,37 50,39 | 100,39 100,37 95,32 | 50,37 4,37 | 103,15.5 101.5,14 U1.33
  Bottom 0.508: v117,27.5 v117,19.5 117,18.25 117.5,17.75 | v77,27 v77,19.5 77,17 | v122.75,10 122.75,13 119.38,16.38 | v127,34 130,34 133,31 133,30 | v83.75,18 84,17.75 84,17 | 92.5,30.5 95,30.5 v100,30.5 106.4,24.1 v106.4,17.7 | v107.38,11.75 v107.38,13.25 v107.38,14.75 | v107.38,14.75 106.4,15.73 106.4,15.9 | 117.5,17.75 114.5,14.75 v107.38,14.75 | 119.38,16.38 118,17.75 117.5,17.75 | v120.75,18 120.75,17.75 119.38,16.38
  Bottom 0.61: 77,17 84,17 90.5,17
  Bottom 0.813: v106.4,17.7 106.4,15.9 106,15.5 103,15.5 | v122.75,10 122.38,9.63
  Bottom 1.016: 90.5,17.12 92,17.12
  Bottom 2.54: 122.38,9.63 SV1.2
  pour Bottom (isolate 0.813, no thermals): 199,37 198,38 120,38 118,36 118,31 119,30 119,27 121,25 123,27 125,27 126,28 126,30 127,30 127,28 125,26 123,26 121,24 120,24 118,26 118,29 116,31 116,36 114,38 86,38 83,35 83,28 85,28 87,26 87,22 86,22 85,23 85,24 82,27 79,27 78,28 78,29 76,29 74,27 74,29 79,34 82,34 82,35 79,38 2,38 1,37 1,30 2.5,28.5 4.5,28.5 6,27 6,25 1,20 1,10 10,1 36,1 41,6 43,6 48,1 66,1 69,4 70,4 81,15 89,15 89,11 93,7 104,7 107,4 131,4 134,1 152,1 157,6 159,6 164,1 190,1 199,10 199,20 194,25 194,27 195.5,28.5 197.5,28.5 199,30
  pour Bottom: 103,37 103,84 104,85 122,85 124,87 124,89 122,91 104,91 103,92 103,134 104,135 121,135 123,137 123,139 121,141 104,141 103,142 103,184 104,185 121,185 123,187 123,189 121,191 104,191 103,192 103,234 104,235 123,235 124,236 124,237 76,237 76,236 77,235 96,235 97,234 97,192 96,191 78,191 76,189 76,187 78,185 96,185 97,184 97,142 96,141 78,141 76,139 76,137 78,135 96,135 97,134 97,92 96,91 78,91 76,89 76,87 78,85 96,85 97,84 97,37
  pour Bottom: 53,37 53,84 54,85 72,85 74,87 74,89 72,91 54,91 53,92 53,134 54,135 72,135 74,137 74,139 72,141 54,141 53,142 53,184 54,185 72,185 74,187 74,189 72,191 54,191 53,192 53,234 54,235 73,235 74,236 74,237 26,237 26,236 27,235 46,235 47,234 47,192 46,191 28,191 26,189 26,187 28,185 46,185 47,184 47,142 46,141 28,141 26,139 26,137 28,135 46,135 47,134 47,92 46,91 28,91 26,89 26,87 28,85 46,85 47,84 47,42 46,41 46,38 47,37
  pour Bottom: 3,37 3,84 4,85 22,85 24,87 24,89 22,91 4,91 3,92 3,134 4,135 22,135 24,137 24,139 22,141 4,141 3,142 3,184 4,185 22,185 24,187 24,189 22,191 4,191 3,192 3,234 4,235 23,235 24,236 24,237 2,237 1,236 1,37
  pour Bottom: 154,37 154,41 153,42 153,84 154,85 172,85 174,87 174,89 172,91 154,91 153,92 153,134 154,135 172,135 174,137 174,139 172,141 154,141 153,142 153,184 154,185 172,185 174,187 174,189 172,191 154,191 153,192 153,234 154,235 173,235 174,236 174,237 126,237 126,236 127,235 146,235 147,234 147,192 146,191 128,191 126,189 126,187 128,185 146,185 147,184 147,142 146,141 128,141 126,139 126,137 128,135 146,135 147,134 147,92 146,91 128,91 126,89 126,87 128,85 146,85 147,84 147,37
  pour Bottom: 199,237 199,37 197,37 197,83 195,85 177,85 175,87 175,89 177,91 196,91 197,92 197,134 196,135 178,135 176,137 176,139 178,141 196,141 197,142 197,184 196,185 178,185 176,187 176,189 178,191 196,191 197,192 197,234 196,235 177,235 176,236 176,237
IFSEL0  (via drill 0.35)
  Top 0.305: U1.26 96.25,12.02 96.25,9 94.25,7 85.75,7 v85.5,6.75 | SJ_S0.2 59,9 60,8 60,7 62,5 v68,5
  Bottom 0.305: v85.5,6.75 83.75,5 v68,5
IFSEL1  (via drill 0.35)
  Top 0.305: U1.27 96.75,11.81 96.75,8.75 94.5,6.5 86.75,6.5 v86.5,6.25 | SJ_S1.2 63.5,9 v66.5,6
  Bottom 0.305: v66.5,6 67,5.5 67,4.5 67.5,4 84.25,4 v86.5,6.25
IRQ
  Top 0.305: U1.32 99.25,10.77 99.25,9.25 105,3.5 137,3.5 140.16,6.66 SV1.9
MISO
  Top 0.305: U1.30 98.25,11.19 98.25,6.5 95.25,3.5 85.5,3.5 78.5,10.5 76,10.5 73.73,8.23 SV2.2 73.73,8.27 72,10 70,10 69,9 69,4.5 68.5,4 50,4 48.5,5.5 48.5,8.5 49,9 ADR2.2
MOSI  (via drill 0.35)
  Top 0.305: U1.28 97.25,11.6 97.25,8 94.75,5.5 85.5,5.5 v80.5,10.5 | ADR1.2 47,9 47.5,8.5 47.5,5.14 49.64,3 69,3 71.19,5.19 SV2.1
  Bottom 0.305: SV2.1 71.19,8.44 73.75,11 80,11 v80.5,10.5
N$1
  Top 0.406: C2B1.2 103.45,29.25 | 103.45,29.25 C2B2.2 | 106,29.25 C1B2.1 C1B1.1 | 106,29.25 R0B.2 | 103.45,29.25 106,29.25
N$2
  Top 0.406: RXN.2 92,22.95 CXN.2
N$3
  Top 0.406: 94,29.25 C1A1.1 C1A2.1 | 94,29.25 R0A.2 | C2A1.1 96.55,29.25 | 96.55,29.25 C2A2.1 | 96.55,29.25 94,29.25
N$19
  Top 0.406: RXP.1 108,22.95 CXP.2
N$26
  Top 0.305: CV6.1 104.02,11.75 U1.7
N$28
  Top 0.305: CV5.1 103.22,14.75 U1.9
NSS/SDA
  Top 0.305: U1.31 98.75,10.98 98.75,5.75 95.5,2.5 83.81,2.5 SV2.4
RST  (via drill 0.35)
  Top 0.305: U1.21 97.65,16 97.25,16 95.75,14.5 v95.75,14.25 | SV1.3 124.92,6.92 122.5,4.5 106.5,4.5 102.5,8.5 v102.5,11
  Bottom 0.305: v95.75,14.25 99,11 v102.5,11
RXN  (via drill 0.35)
  Top 0.305: U1.13 102.65,17 v103,17 | v93,18.88 93,19.25 92.05,20.2 RVN.2
  Top 0.406: CXN.1 90.05,20.5 RVN.2
  Bottom 0.305: v93,18.88 93.75,18.12 100.38,18.12 101.5,17 v103,17
RXP
  Top 0.305: U1.12 102.35,16 103.5,16 104.25,16.75 107,16.75 107.95,17.7
  Top 0.406: CXP.1 109.95,20.5 RVP.1 107.95,17.7
S1  (via drill 0.35)
  Top 0.305: U5.11 86.47,30.02 87.5,29 87.5,21.75 | v86,10 87.5,11.5 87.5,21.75 | U6.11 84.97,22.02 v85.25,21.75 | v87.25,21.75 87.5,21.75 | U3.11 124.97,30.02 126.5,28.5 v126.5,27.5 | U4.11 126.28,22.02 v126.5,22.25 137.62,11.13 SV1.8
  Bottom 0.305: SV1.8 137.62,6.62 133,2 92,2 86,8 v86,10 | v85.25,21.75 v87.25,21.75 | v126.5,27.5 v126.5,22.25
S2  (via drill 0.35)
  Top 0.305: U5.10 86.38,29.38 87,28.75 87,22.5 86.5,22 86.5,21 v86.75,20.75 87,20.5 87,12.25 v86.75,12 | U6.10 84.38,21.38 85,20.75 v85.25,20.75 | U3.10 124.38,29.38 125.5,28.25 v125.5,27 | U4.10 125.38,21.38 v125.5,21.25 135.08,11.67 SV1.7
  Bottom 0.305: SV1.7 135.08,6.58 131.5,3 92,3 87,8 87,11.75 v86.75,12 | v85.25,20.75 v86.75,20.75 | v125.5,27 v125.5,21.25
S3  (via drill 0.35)
  Top 0.305: U5.9 86.03,28.73 86.5,28.25 86.5,22.75 86,22.25 86,20 | v86.25,13.75 86.5,14 86.5,19.5 86,20 | U6.9 84.28,20.73 85,20 86,20 | U3.9 123.78,28.73 124.5,28 v124.5,26.5 | U4.9 124.28,20.73 v124.5,20.5 132.54,12.46 SV1.6
  Bottom 0.305: SV1.6 132.54,6.54 130,4 92,4 88,8 88,12 v86.25,13.75 | v124.5,26.5 v124.5,20.5
SCK/SCL  (via drill 0.35)
  Top 0.305: U1.29 97.75,11.4 97.75,7.25 95,4.5 85.5,4.5 v81,9
  Bottom 0.305: SV2.3 76.27,8.27 78,10 80,10 v81,9
TX1
  Top 0.203: U1.17 99.47,17.08
  Top 0.406: 99.47,17.08 98.8,17.75 L0A.1
TX2
  Top 0.406: U1.15 101.38,17.14 101.38,18 101.2,18.18 L0B.1
VMID  (via drill 0.35)
  Top 0.305: CVM.1 102.25,17.75 v102.25,18 102.25,17.31 U1.14 | RVN.1 93.95,19.3 v94.38,18.88
  Top 0.406: CVM.1 104.1,18 105.6,19.5 105.6,20.05 RVP.2
  Bottom 0.305: v102.25,18 101.62,18.62 94.62,18.62 v94.38,18.88
XTAL1
  Top 0.305: U1.19 98.06,17 96.75,17 95,15.25 93.05,15.25 92.2,14.4 U2.P$1 | 90.75,15.55 CX1.1
  Top 0.406: U2.P$1 90.75,15.55
XTAL2
  Top 0.305: U1.20 97.85,16.5 97,16.5 95,14.5 95,13.35 93.8,12.15 U2.P$3 93.65,11.75
  Top 0.406: CX2.1 93.65,11.75

### Text on the board
tPlace: 14 | 10 | 4 | 3 | 01110 | 01010 | 10100 | 10011 | 12 | 11 | 5 | 2 | 01100 | 01011 | 10101 | 10010 | 13 | 8 | 7 | 0 | 01101 | 01000 | 10111 | 10000 | 15 | 9 | 6 | 1 | 01111 | 01001 | 10110 | 10001 | SPI | 1 | 0 | I2C
tNames: WayWayWay | VCC | MOSI | MISO | SCK/SCL | NSS/SDA | GND | RST | EN2 | EN1 | S3 | S2 | S1 | IRQ | Author: Alec Paul / 3 April, 2024 / RFID Reader PCB v1.0 / MSD P18661 / Autonomous Chessboard / Rochester Institute of Technology